# Altium schematic sheet Sheet1.SchDoc
size A; SheetNumber: 1; SheetTotal: 7
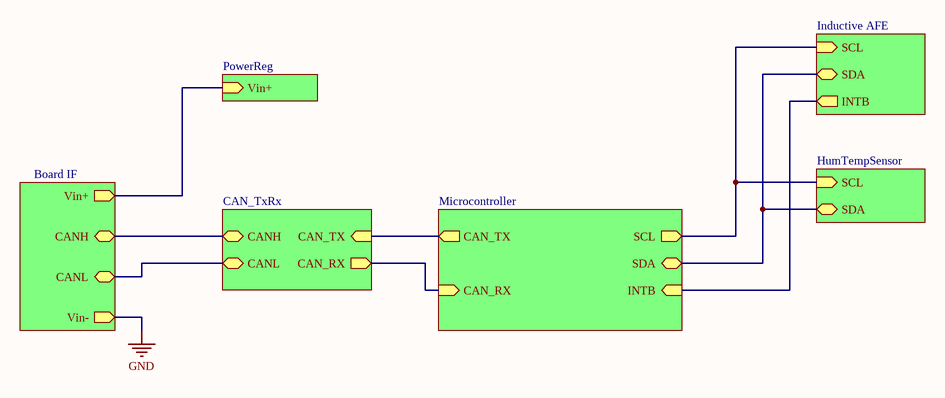
[diagram p0: Sheet1.SchDoc]

## Parts
FID1  Fiducial  [FID]  (value not drawn)
FID2  Fiducial  [FID]  (value not drawn)
FID3  Fiducial  [FID]  (value not drawn)

## Sub-sheets
Board IF = BoardIF.SchDoc: Vin+ (out), CANH (bidir), CANL (bidir), Vin- (out)
CAN_TxRx = CAN_TxRx.SchDoc: CANH (bidir), CANL (bidir), CAN_TX (in), CAN_RX (out)
HumTempSensor = HumTempSensor.SchDoc: SCL (in), SDA (bidir)
Inductive AFE = Sense_LDC1612.SchDoc: SCL (in), SDA (bidir), INTB (out)
Microcontroller = Microcontroller_STM32F04.SchDoc: SDA (bidir), SCL (out), CAN_TX (out), CAN_RX (in), INTB (in)
PowerReg = PowerReg.SchDoc: Vin+ (in)

## Nets
GND: sheet Board IF/Vin-
(unnamed): sheet Inductive AFE/SCL, sheet Microcontroller/SCL, sheet HumTempSensor/SCL
(unnamed): sheet Inductive AFE/SDA, sheet Microcontroller/SDA, sheet HumTempSensor/SDA
(unnamed): sheet Inductive AFE/INTB, sheet Microcontroller/INTB
(unnamed): sheet Microcontroller/CAN_TX, sheet CAN_TxRx/CAN_TX
(unnamed): sheet Microcontroller/CAN_RX, sheet CAN_TxRx/CAN_RX
(unnamed): sheet Board IF/Vin+, sheet PowerReg/Vin+
(unnamed): sheet Board IF/CANH, sheet CAN_TxRx/CANH
(unnamed): sheet Board IF/CANL, sheet CAN_TxRx/CANL